# Altium schematic sheet nufsr-fsr.schdoc: NUSense
size A4; Organization: Elby Designs; Address1: 9 Follan Close; Address2: Kariong; Address3: NSW 2250; Address4: Australia; Revision: 1; SheetNumber: 12; SheetTotal: 15; DrawnBy: Force-Sense Resistors (FSR); Engineer: Laurie Biddulph; PageSetup: Record=PageOptions|CenterHorizontal=True|CenterVertical=True|PrintScale=1.38|XCorrection=1.00|YCorrection=1.00|PrintKind=1|BorderSize=5000000|LeftOffset=0|BottomOffset=0|Orientation=2|PaperLength=1000|PaperWidth=1000|Scale=100|PaperSource=7|PrintQuality=-4|MediaType=1|DitherType=10|PaperKind=A3|PrintScaleMode=1
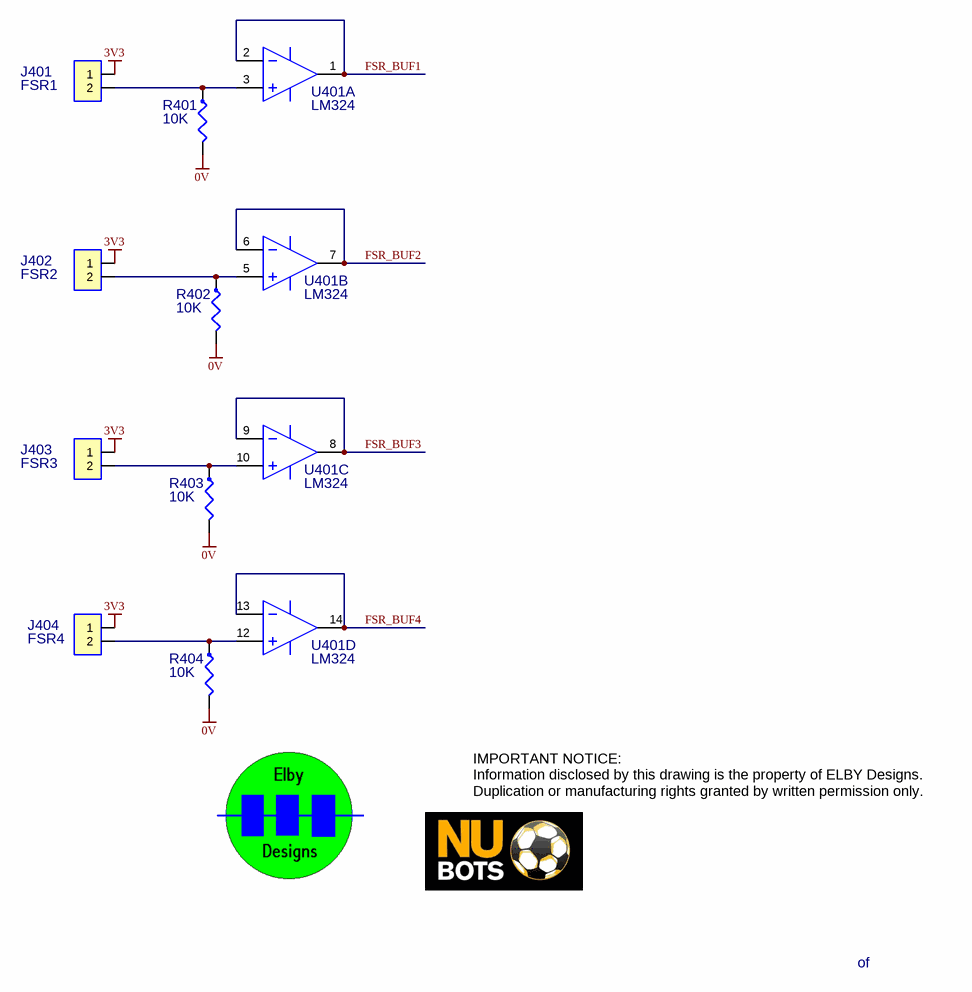
[diagram p0: nufsr-fsr.schdoc]

## Parts
J401  FSR1  [JST-B2B-PH]
J402  FSR2  [JST-B2B-PH]
J403  FSR3  [JST-B2B-PH]
J404  FSR4  [JST-B2B-PH]
R401  10K  [0603(LB)]
R402  10K  [0603(LB)]
R403  10K  [0603(LB)]
R404  10K  [0603(LB)]
U401  LM324  [SO-14(LB)]  (parts A,B,C,D of 5)

## Nets
0V: R401.2 R402.2 R403.2 R404.2
3V3: J401.1 J402.1 J403.1 J404.1
FSR_BUF1: U401.1(OUT) U401.2(IN1-)
FSR_BUF2: U401.6(IN2-) U401.7(OUT)
FSR_BUF3: U401.8(OUT) U401.9(IN3-)
FSR_BUF4: U401.13(IN4-) U401.14(OUT)
NetJ401_2: J401.2 R401.1 U401.3(IN1+)
NetJ402_2: J402.2 R402.1 U401.5(IN2+)
NetJ403_2: J403.2 R403.1 U401.10(IN3+)
NetJ404_2: J404.2 R404.1 U401.12(IN4+)

## Notes on the sheet
- IMPORTANT NOTICE:
  Information disclosed by this drawing is the property of ELBY Designs.
  Duplication or manufacturing rights granted by written permission only.
- of

## Library data of the parts
J401-J404 = CON2(LB): EMRP: HM-3412 + HM-3402
R401-R404 = RM-10K(LB): 0.5W 1% Metal Film Resistor; EMRP: RM-10K
U401 = LM324(LB): Quad Low-noise JFET Op-amp; EMRP: SI-3-LM324